# EAGLE design Balancing Circuit Module (EAGLE 5.12)
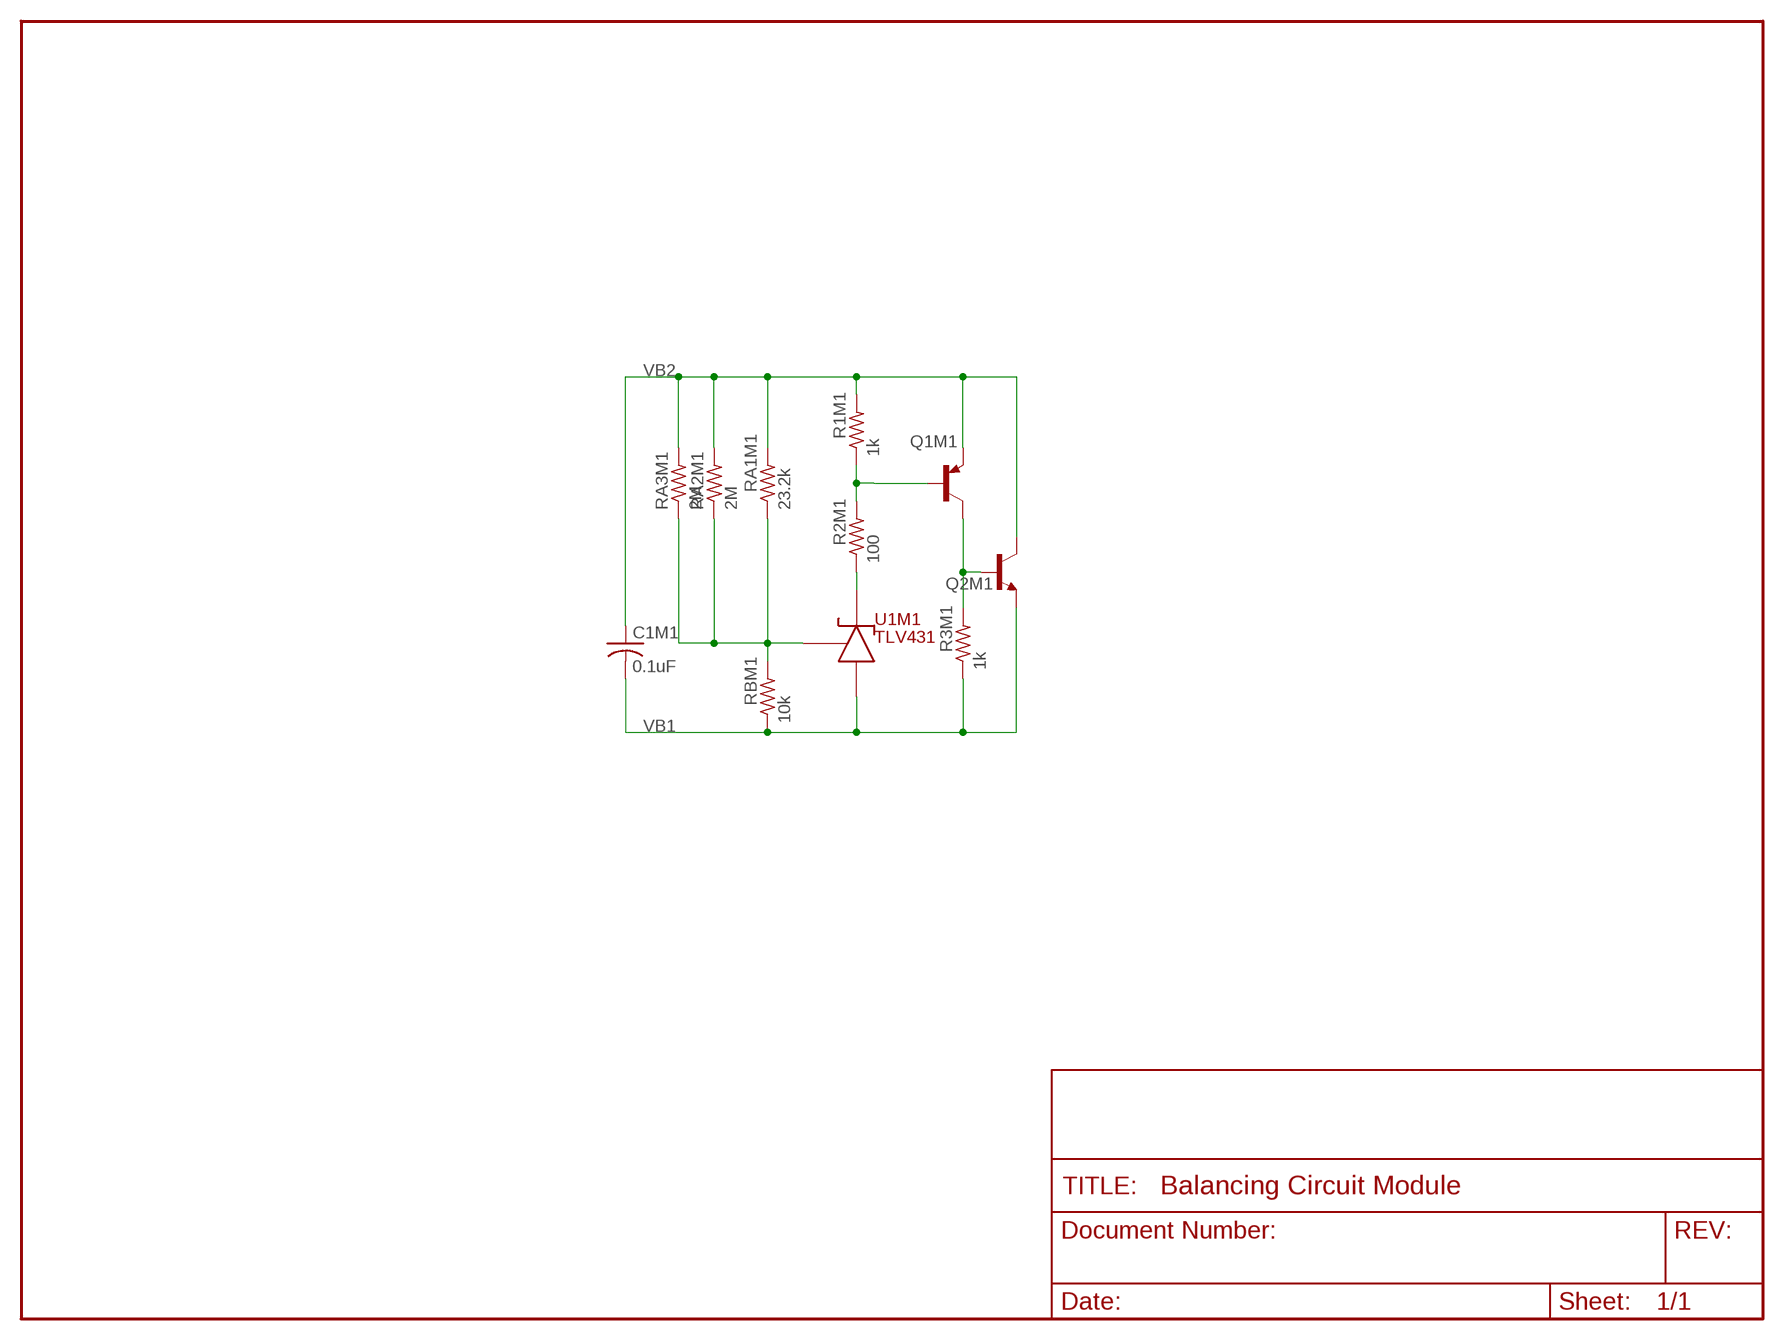
[diagram p0: schematic, sheet 1]

## Parts
C1M1  0.1uF  C-USC0603  [C0603]
Q1M1  MMBT3906LT1SMD  [SOT23-BEC]
Q2M1  D44VH10  -NPN-TO220V  [TO220V]
R1M1  1k  R-US_R0603  [R0603]
R2M1  100  R-US_R0603  [R0603]
R3M1  1k  R-US_R0603  [R0603]
RA1M1  23.2k  R-US_R0603  [R0603]
RA2M1  2M  R-US_R0603  [R0603]
RA3M1  2M  R-US_R0603  [R0603]
RBM1  10k  R-US_R0603  [R0603]
U1M1  TLV431  [SOT-23-5_(DBV-R-PDSO-G5)]

## Nets
N$1: Q1M1.C Q2M1.1(B) R3M1.2
N$2: Q1M1.B R1M1.1 R2M1.2
N$4: RA1M1.1 RA2M1.1 RA3M1.1 RBM1.2 U1M1.4(P$2.REF)
N$56: R2M1.1 U1M1.3(P$1.CATHODE)
VB1: C1M1.2 Q2M1.3(E) R3M1.1 RBM1.1 U1M1.5(P$3.ANODE)
VB2: C1M1.1 Q1M1.E Q2M1.2(C) R1M1.2 RA1M1.2 RA2M1.2 RA3M1.2

## Library data of the parts
C1M1 = resistor:C-US: CAPACITOR, American symbol
Q1M1 = transistor-pnp:MMBT3906*: PNP Transistror
Q2M1 = transistor:*-NPN-: NPN Transistror BF959 corrected 2008.03.06
R1M1 R2M1 R3M1 RA1M1 RA2M1 RA3M1 RBM1 = resistor:R-US_: RESISTOR, American symbol
U1M1 = TI:TLV431: TLV431 Low-Voltage Adjustable Precision Shunt Regulator

## Board
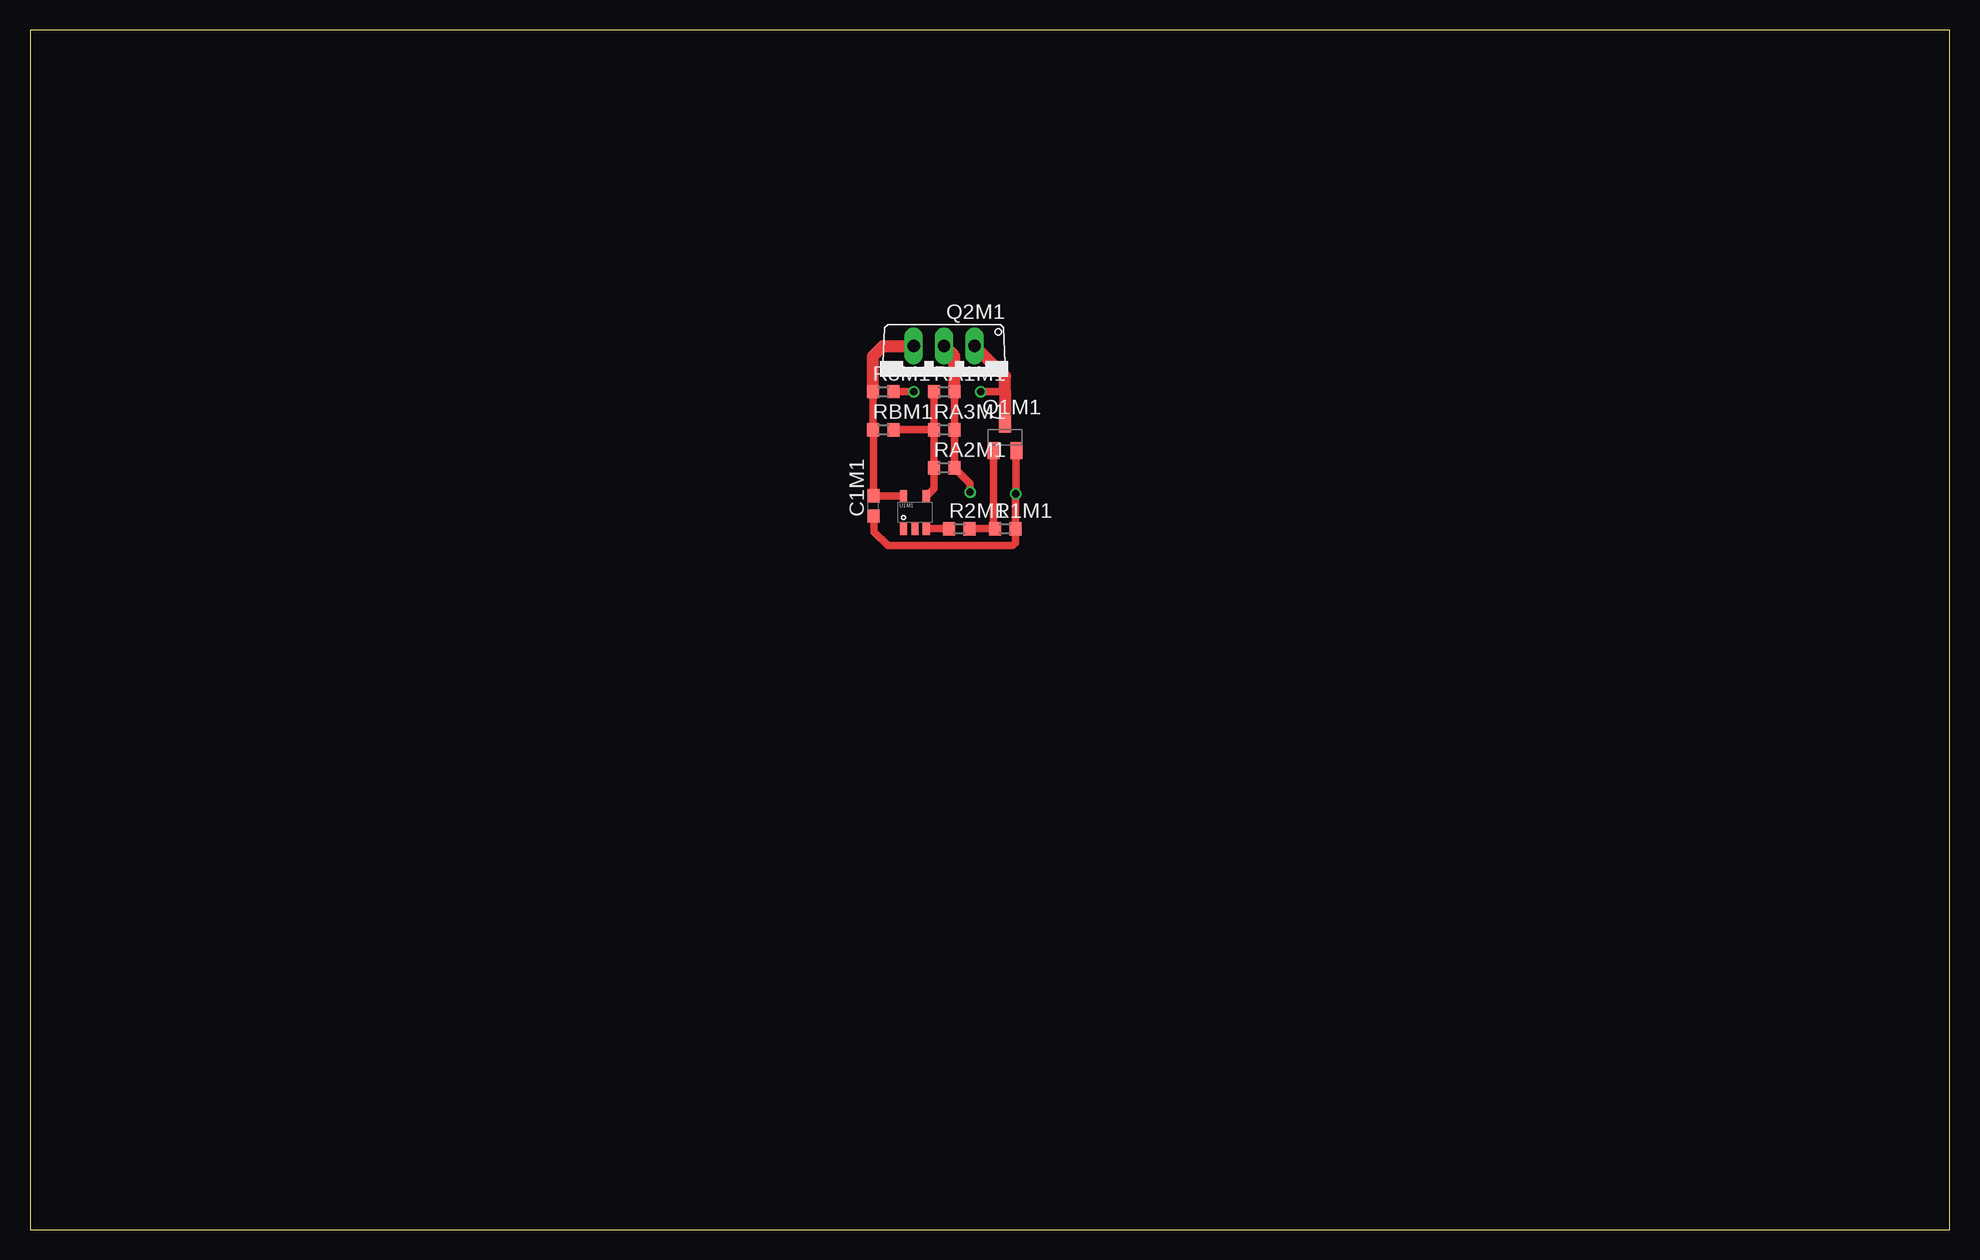
[diagram p1: board, top side]
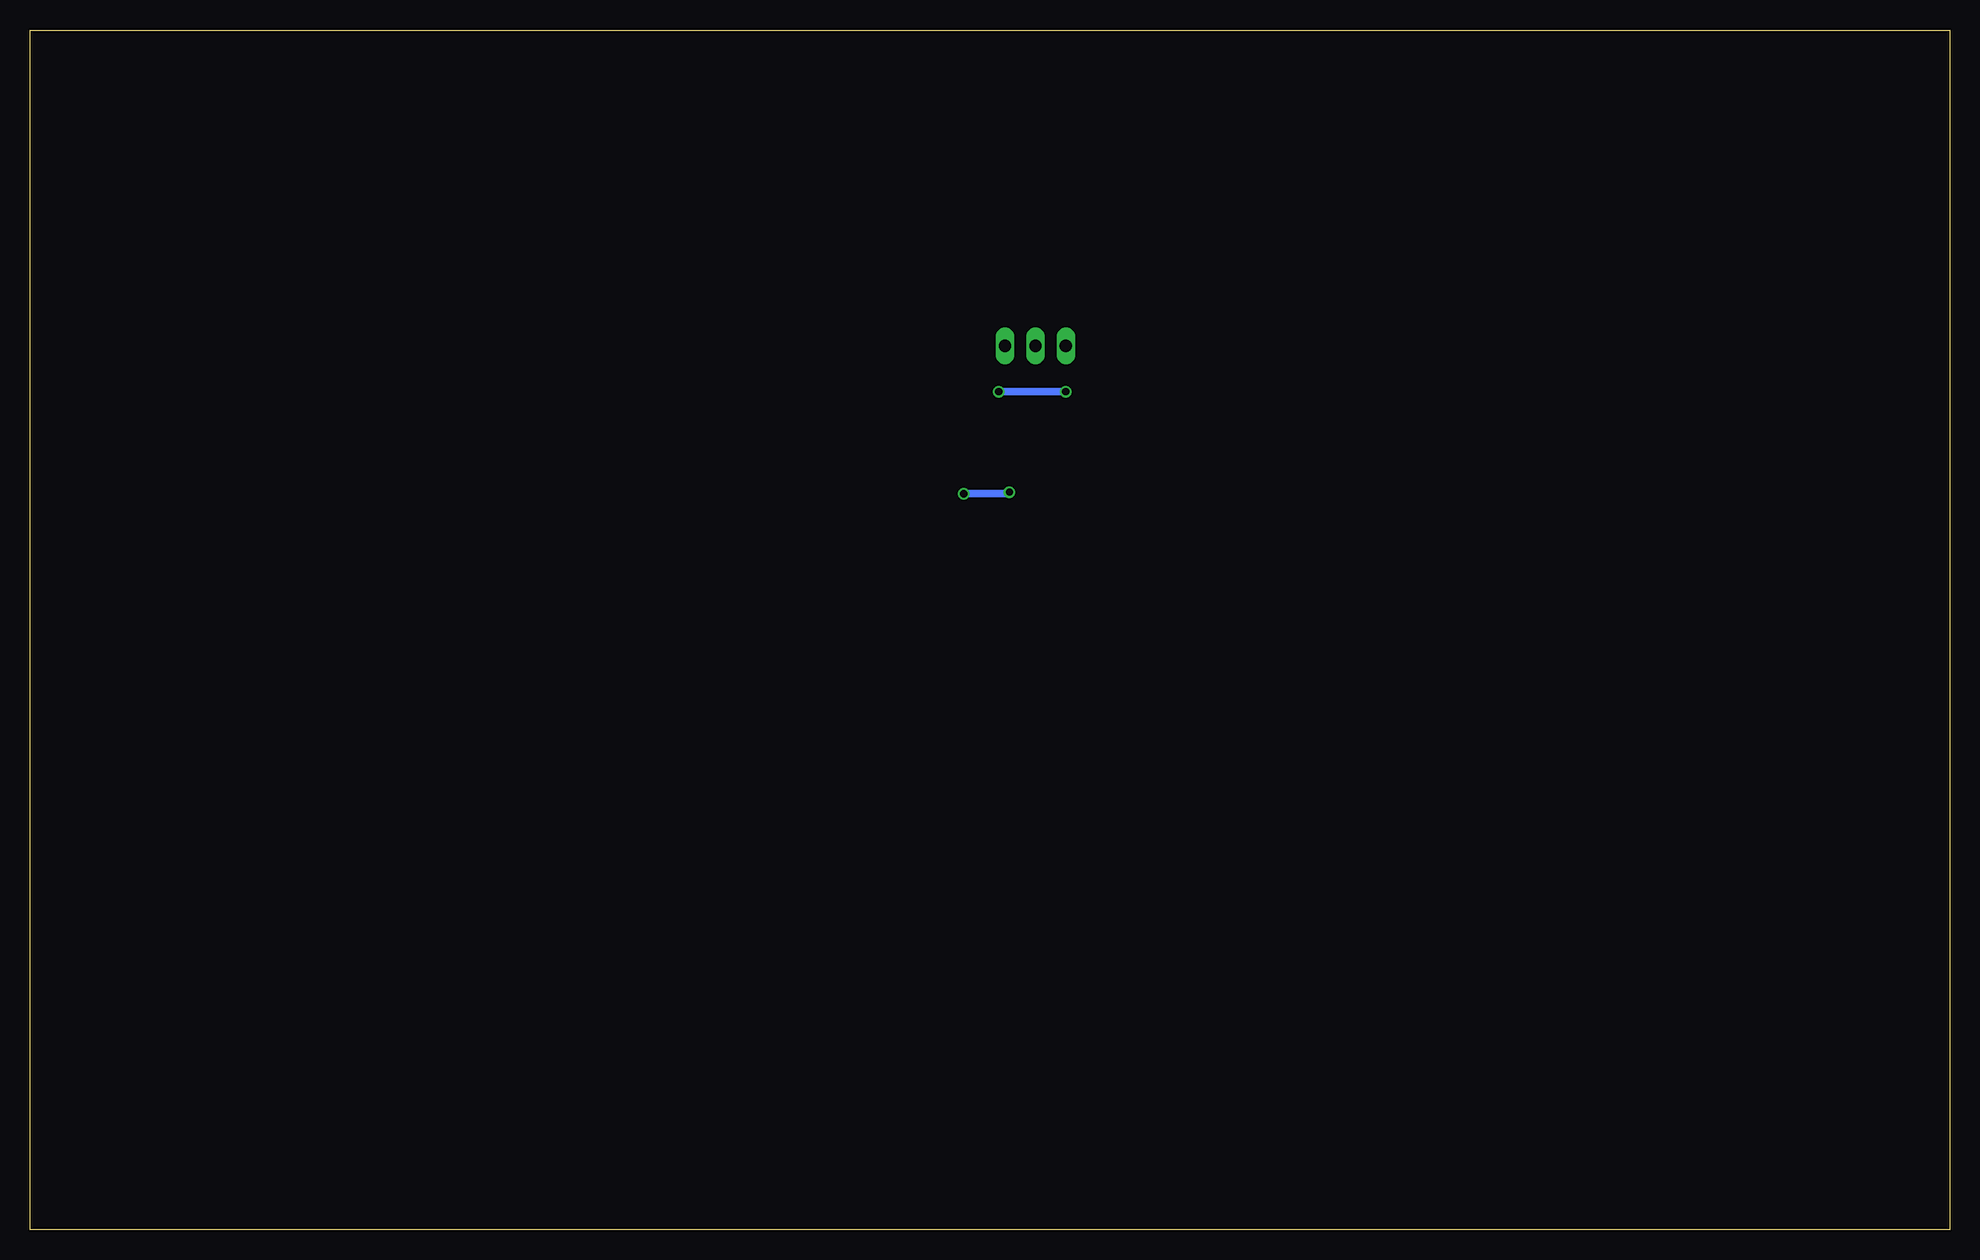
[diagram p2: board, bottom side, seen from below]

Size 160 x 100 mm. Coordinates in mm from the lower left corner, seen from the top.
Outline: 0,0 160,0 160,100 0,100 0,0
Copper layers (1*16): Top 0.0356mm / dielectric 1.5011mm / Bottom 0.0356mm
Design rules "OSH Park 2-layer": minimum track width 6mil, minimum drill 13mil, track to track 6mil, track to pad 6mil, pad to pad 6mil, via to via 6mil, smd to smd 6mil, copper to edge 15mil, drill to drill 6mil, minimum pad ring 7mil, minimum via ring 7mil, stop-mask expansion 4mil, vias tented up to drill 25mil, thermal gap 10mil

### Footprints (pad centres in the part's own frame; a part is rotated, then mirrored left to right if it is on the bottom)
C0603 = smd 1.1 x 1: 1 -0.85,0; 2 0.85,0
SOT23-BEC = smd 1 x 1.4: B -0.95,-1.1; C 0,1.1; E 0.95,-1.1
TO220V = drill 1.016 long: 1 -2.54,-2.54; 2 0,-2.54; 3 2.54,-2.54
R0603 = smd 1 x 1.1: 1 -0.85,0; 2 0.85,0
SOT-23-5_(DBV-R-PDSO-G5) = smd 0.6 x 1.05: 1 -0.95,-1.35; 2 0,-1.35; 3 0.95,-1.35; 4 0.95,1.35; 5 -0.95,1.35

### Placement (x,y rotation side)
C1M1  70.29,60.33 90 top
Q1M1  81.28,66.04 0 top
Q2M1  76.2,71.12 180 top
R1M1  81.28,58.42 0 top
R2M1  77.47,58.42 0 top
R3M1  71.12,69.85 0 top
RA1M1  76.2,69.85 0 top
RA2M1  76.2,63.5 0 top
RA3M1  76.2,66.67 0 top
RBM1  71.12,66.67 0 top
U1M1  73.76,59.79 0 top

### Tracks (layer width: path | path; a pad name or v marks a point on that pad's centre or on a via)
N$1  (via drill 0.6)
  Top 0.61: R3M1.2 v73.66,69.85 | v79.25,69.85 81.28,69.85
  Top 1.016: Q2M1.1 81.28,71.12 81.28,69.85 Q1M1.C
  Bottom 0.61: v73.66,69.85 v79.25,69.85
N$2
  Top 0.61: R2M1.2 R1M1.1 80.33,58.52 Q1M1.B
N$4
  Top 0.61: RA3M1.1 RA1M1.1 | RA3M1.1 RA2M1.1 75.35,61.78 U1M1.4 | RA3M1.1 RBM1.2
N$56
  Top 0.61: U1M1.3 74.73,58.42 R2M1.1
VB1
  Top 0.61: R3M1.1 RBM1.1 70.29,66.65 C1M1.2 70.33,61.14 U1M1.5
  Top 1.016: Q2M1.3 71.12,73.66 70.27,72.81 R3M1.1
VB2  (via drill 0.6)
  Top 0.61: RA1M1.2 RA3M1.2 RA2M1.2 78.36,62.19 v78.36,61.47 | R1M1.2 82.13,58.13 | C1M1.1 70.36,59.41 70.36,58.17 71.5,57.02 81.92,57.02 82.13,57.24 R1M1.2 | R1M1.2 82.13,61.3 v82.17,61.34 82.17,64.88 Q1M1.E
  Top 1.016: Q2M1.2 77.05,72.81 RA1M1.2
  Bottom 0.61: v78.36,61.47 78.49,61.34 v82.17,61.34